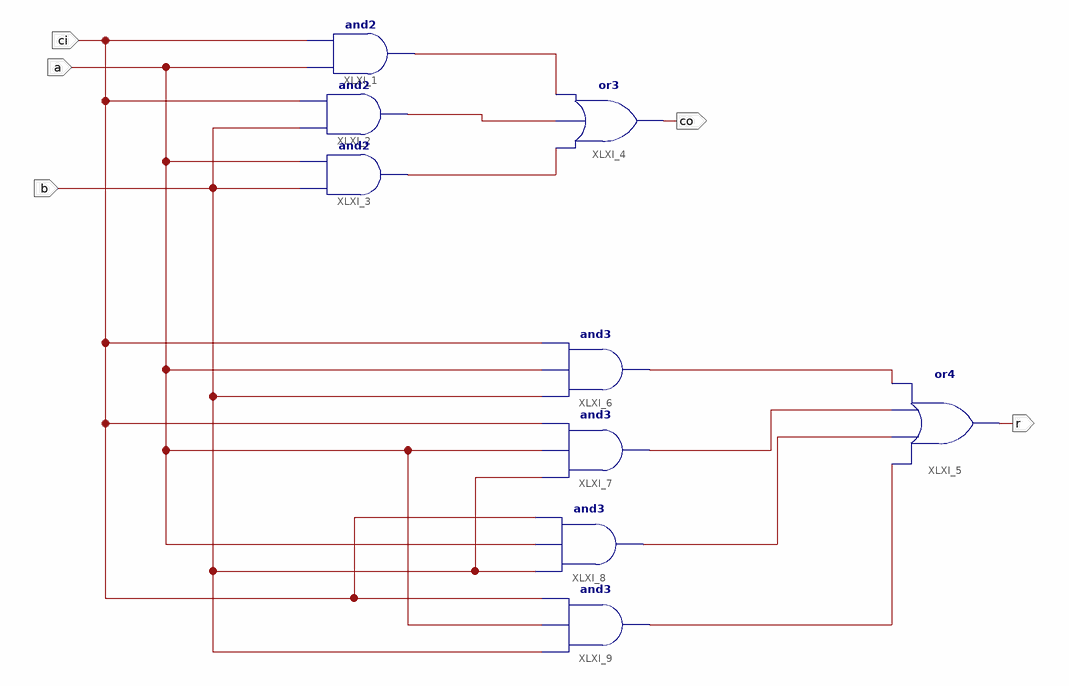
[diagram p0: schematic sheet 1]
// Xilinx ISE schematic add1b.sch (spartan3e) as structural Verilog: 9 symbols, 5 ports
module add1b (
  input  b,
  input  a,
  input  ci,
  output co,
  output r
);

  wire XLXN_4, XLXN_5, XLXN_6, XLXN_26, XLXN_27, XLXN_28, XLXN_29;

  and XLXI_1 (XLXN_4, a, ci);
  and XLXI_2 (XLXN_5, b, ci);
  and XLXI_3 (XLXN_6, b, a);
  or XLXI_4 (co, XLXN_6, XLXN_5, XLXN_4);
  or XLXI_5 (r, XLXN_29, XLXN_28, XLXN_27, XLXN_26);
  and XLXI_6 (XLXN_26, b, a, ci);
  and XLXI_7 (XLXN_27, b, a, ci);
  and XLXI_8 (XLXN_28, b, a, ci);
  and XLXI_9 (XLXN_29, b, a, ci);
endmodule
